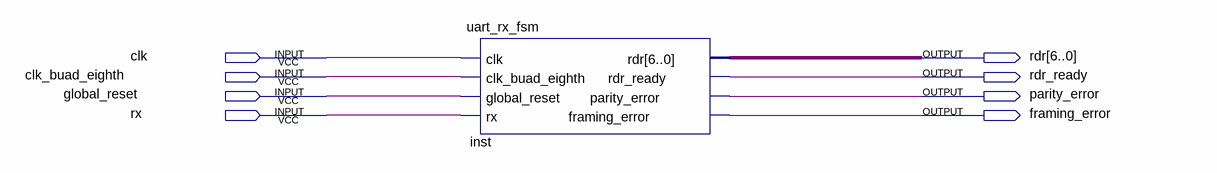
[diagram p0: schematic sheet]
// Quartus schematic rxTest.bdf as structural Verilog: 1 symbols, 8 pins
module rxTest (
  input  clk,
  input  clk_buad_eighth,
  input  global_reset,
  input  rx,
  output [6:0] rdr,
  output rdr_ready,
  output parity_error,
  output framing_error
);

  uart_rx_fsm inst (
    .clk(clk), .clk_buad_eighth(clk_buad_eighth), .global_reset(global_reset), .rx(rx), .rdr(rdr),
    .rdr_ready(rdr_ready), .parity_error(parity_error), .framing_error(framing_error));
endmodule
